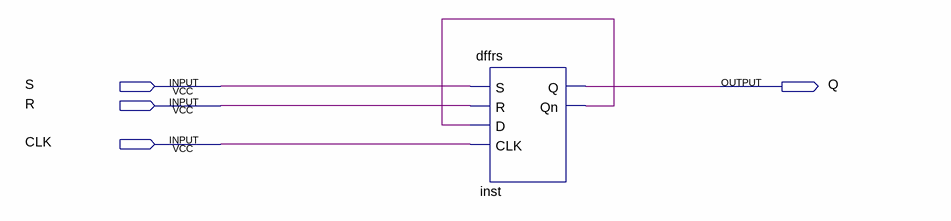
[diagram p0: schematic sheet]
// Quartus schematic divisordefreq2.bdf as structural Verilog: 1 symbols, 4 pins
module divisordefreq2 (
  input  S,
  input  R,
  input  CLK,
  output Q
);

  wire inst_qn;

  dffrs inst (.S(S), .R(R), .D(inst_qn), .CLK(CLK), .Q(Q), .Qn(inst_qn));
endmodule
